# EAGLE schematic sc (EAGLE 6.5.0)
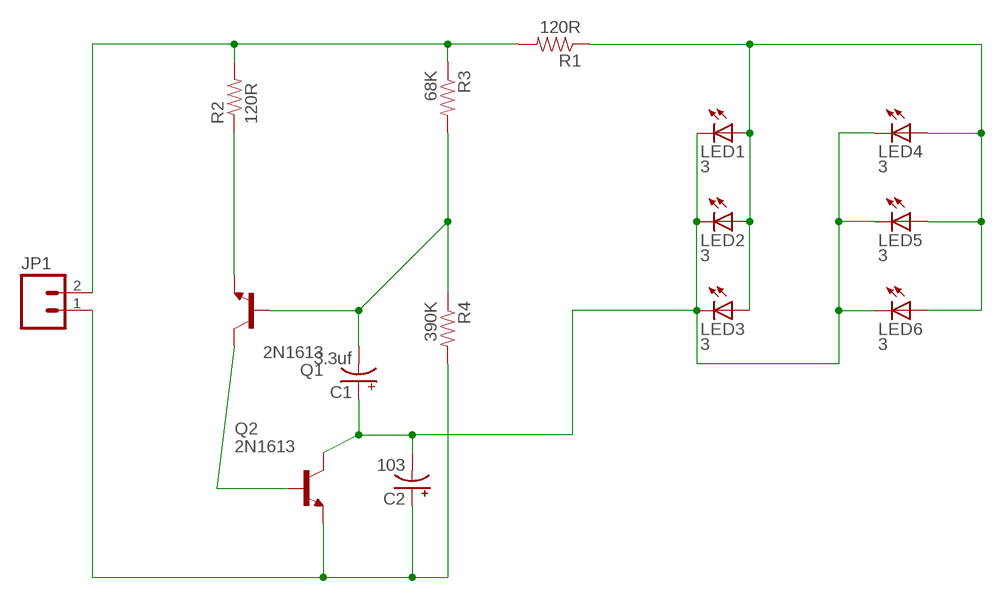
[diagram p0: schematic, sheet 1]

## Parts
C1  3.3uf  CAP_POLPTH2  [CPOL-RADIAL-10UF-25V]
C2  103  CAP_POLPTH2  [CPOL-RADIAL-10UF-25V]
JP1  M02JST-PTH-2  [JST-2-PTH]
LED1  3  LED3MM  [LED3MM]
LED2  3  LED3MM  [LED3MM]
LED3  3  LED3MM  [LED3MM]
LED4  3  LED3MM  [LED3MM]
LED5  3  LED3MM  [LED3MM]
LED6  3  LED3MM  [LED3MM]
Q1  2N1613  [TO5]
Q2  2N1613  [TO5]
R1  120R  RESISTORPTH-1/4W  [AXIAL-0.4]
R2  120R  RESISTORPTH-1/4W  [AXIAL-0.4]
R3  68K  RESISTORPTH-1/4W  [AXIAL-0.4]
R4  390K  RESISTORPTH-1/4W  [AXIAL-0.4]

## Nets
N$1: JP1.2 R1.P$2 R2.P$2 R3.P$1
N$2: Q1.1(E) R2.P$1
N$3: C1.2(-) Q1.2(B) R3.P$2 R4.P$1
N$4: LED1.A LED2.A LED3.A LED4.A LED5.A LED6.A R1.P$1
N$8: Q1.3(C) Q2.2(B)
N$9: C1.1(+) C2.2(-) LED1.K(C) LED2.K(C) LED3.K(C) LED4.K(C) LED5.K(C) LED6.K(C) Q2.3(C)
N$11: C2.1(+) JP1.1 Q2.1(E) R4.P$2

## Library data of the parts
C1 C2 = SparkFun:CAP_POL: Capacitor Polarized These are standard SMD and PTH capacitors. Normally 10uF, 47uF, and 100uF in electrolytic and tantalum varieties. Always verify the external diameter of the through hole cap, it varies with capacity, voltage, and manufacturer. The EIA devices should be standard.
JP1 = SparkFun:M02: Header 2 Standard 2-pin 0.1" header. Use with straight break away headers (SKU : PRT-00116), right angle break away headers (PRT-00553), swiss pins (PRT-00743), machine pins (PRT-00117), and female headers (PRT-00115). Molex polarized connector foot print use with SKU : PRT-08233 with associated crimp pins and housings.
LED1-LED6 = adafruit:LED: LED OSRAM: - CHIPLED LG R971, LG N971, LY N971, LG Q971, LY Q971, LO R971, LY R971 LH N974, LH R974 LS Q976, LO Q976, LY Q976 LO Q996 - Hyper CHIPLED LW Q18S LB Q993, LB Q99A, LB R99A - SideLED LS A670, LO A670, LY A670, LG A670, LP A670 LB A673, LV A673, LT A673, LW A673 LH A674 LY A675 LS A676, LA A676, LO A676, LY A676, LW A676 LS A679, LY A679, LG A679 - Hyper Micro SIDELED® LS Y876, LA Y876, LO Y876, LY Y876 LT Y87S - SmartLED LW L88C, LW L88S LB L89C, LB L89S, LG L890 LS L89K, LO L89K, LY L89K LS L896, LA L896, LO L896, LY L896 - TOPLED LS T670, LO T670, LY T670, LG T670, LP T670 LSG T670, LSP T670, LSY T670, LOP T670, LYG T670 LG T671, LOG T671, LSG T671 LB T673, LV T673, LT T673, LW T673 LH T674 LS T676, LA T676, LO T676, LY T676, LB T676, LH T676, LSB T676, LW T676 LB T67C, LV T67C, LT T67C, LS T67K, LO T67K, LY T67K, LW E67C LS E67B, LA E67B, LO E67B, LY E67B, LB E67C, LV E67C, LT E67C LW T67C LS T679, LY T679, LG T679 LS T770, LO T770, LY T770, LG T770, LP T770 LB T773, LV T773, LT T773, LW T773 LH T774 LS E675, LA E675, LY E675, LS T675 LS T776, LA T776, LO T776, LY T776, LB T776 LHGB T686 LT T68C, LB T68C - Hyper Mini TOPLED® LB M676 - Mini TOPLED Santana® LG M470 LS M47K, LO M47K, LY M47K Source: http://www.osram.convergy.de/
Q1 Q2 = transistor:2N1613: NPN TRANSISTOR
R1-R4 = SparkFun:RESISTOR: Resistor Basic schematic elements and footprints for 0603, 1206, and PTH resistors.

## Net classes
0 default: width 7.62 mm, drill 2.54 mm, clearance 5.08 mm